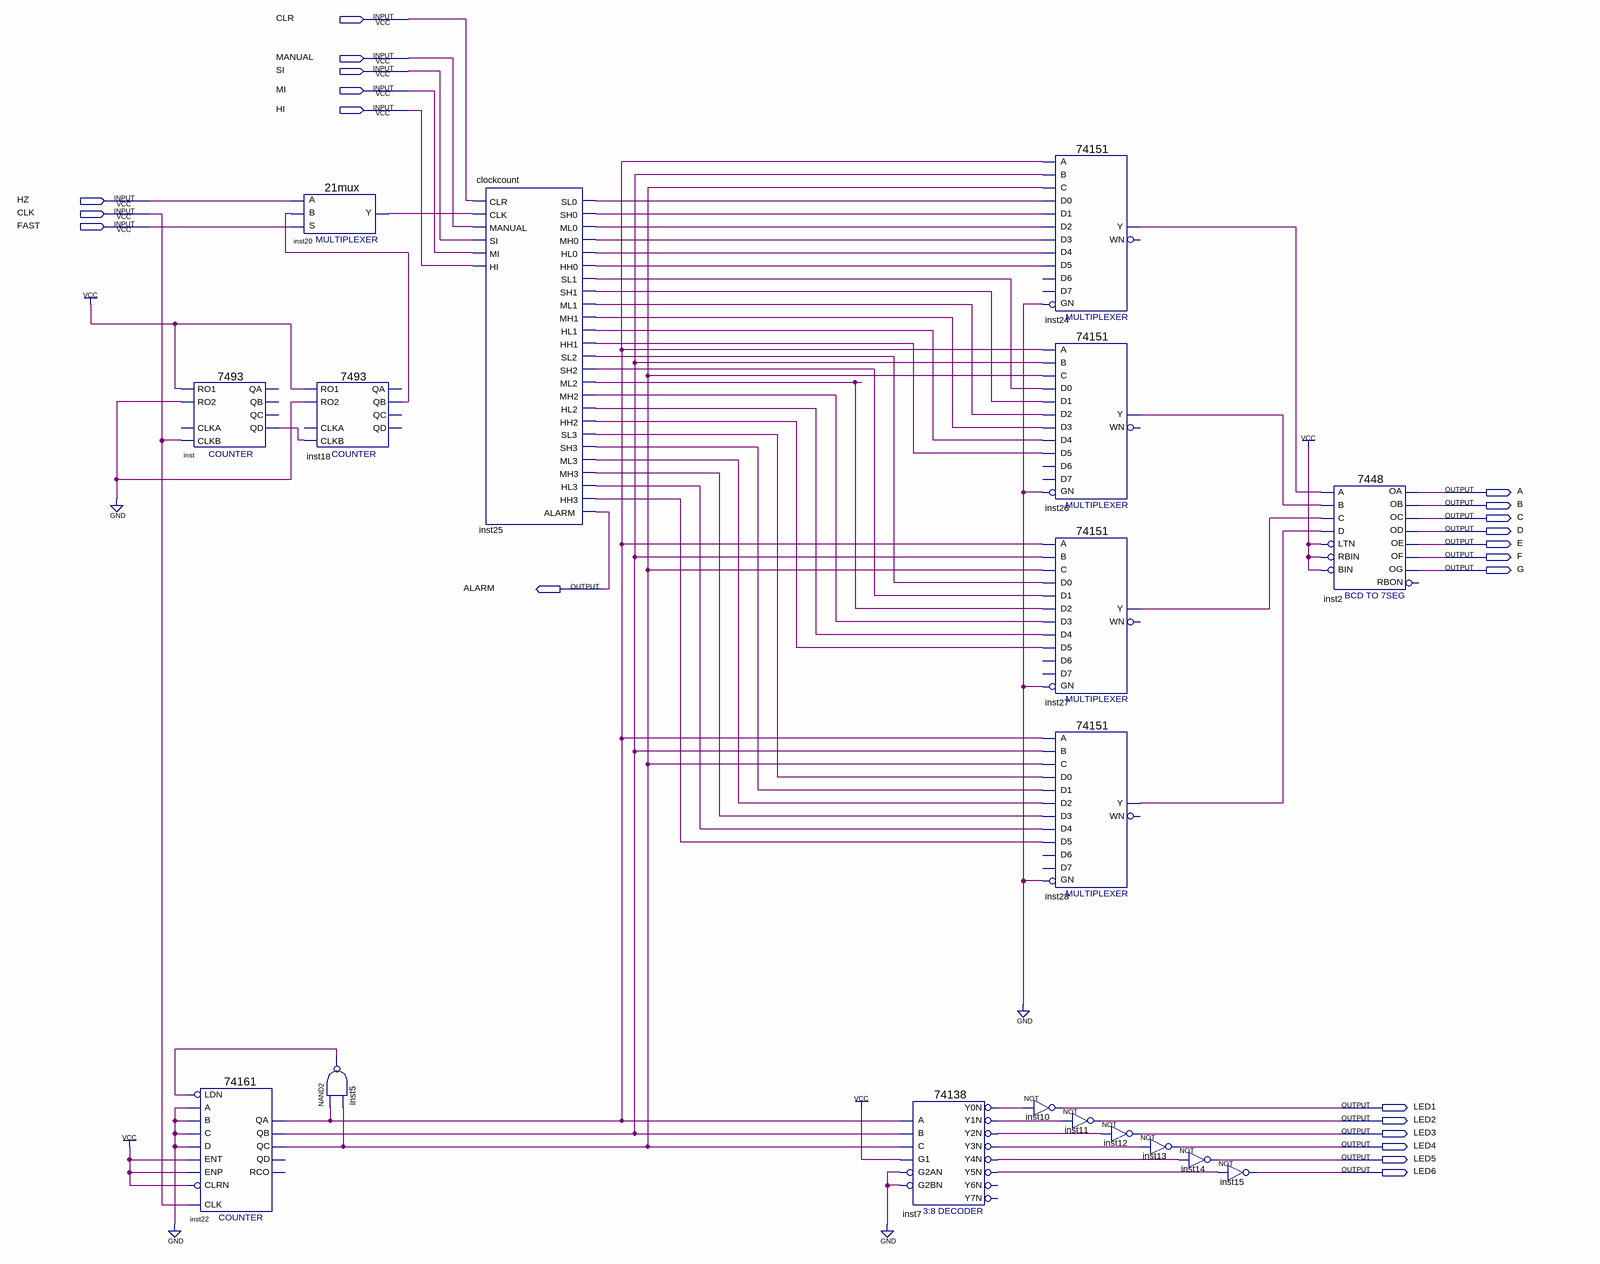
[diagram p0: schematic sheet]
// Quartus schematic clock.bdf as structural Verilog: 18 symbols, 22 pins
module clock (
  input  CLR,
  input  MANUAL,
  input  SI,
  input  MI,
  input  HI,
  input  HZ,
  input  CLK,
  input  FAST,
  output A,
  output B,
  output C,
  output D,
  output E,
  output F,
  output G,
  output ALARM,
  output LED1,
  output LED2,
  output LED3,
  output LED4,
  output LED5,
  output LED6
);

  wire inst5_out, inst7_y0n, inst7_y1n, inst7_y2n, inst7_y3n, inst7_y4n, inst7_y5n, inst18_qb, inst20_y,
       inst22_qa, inst22_qb, inst22_qc, inst24_y, inst25_hh0, inst25_hh1, inst25_hh2, inst25_hh3, inst25_hl0,
       inst25_hl1, inst25_hl2, inst25_hl3, inst25_mh0, inst25_mh1, inst25_mh2, inst25_mh3, inst25_ml0,
       inst25_ml1, inst25_ml2, inst25_ml3, inst25_sh0, inst25_sh1, inst25_sh2, inst25_sh3, inst25_sl0,
       inst25_sl1, inst25_sl2, inst25_sl3, inst26_y, inst27_y, inst28_y, inst_qd;

  \7493  inst (.RO1(1'b1), .RO2(1'b0), .CLKB(CLK), .QD(inst_qd));  // open: CLKA, QC, QB, QA
  \74161  inst22 (
    .CLRN(1'b1), .CLK(CLK), .ENP(1'b1), .LDN(inst5_out), .A(1'b0), .D(1'b0), .ENT(1'b1), .B(1'b0), .C(1'b0),
    .QC(inst22_qc), .QB(inst22_qb), .QA(inst22_qa));  // open: QD, RCO
  \21mux  inst20 (.S(FAST), .B(inst18_qb), .A(HZ), .Y(inst20_y));
  \7493  inst18 (.RO1(1'b1), .RO2(1'b0), .CLKB(inst_qd), .QB(inst18_qb));  // open: CLKA, QC, QA, QD
  nand inst5 (inst5_out, inst22_qa, inst22_qc);
  clockcount inst25 (
    .CLR(CLR), .CLK(inst20_y), .SI(SI), .MANUAL(MANUAL), .MI(MI), .HI(HI), .SL0(inst25_sl0),
    .SL1(inst25_sl1), .SL2(inst25_sl2), .SL3(inst25_sl3), .SH0(inst25_sh0), .SH1(inst25_sh1),
    .SH2(inst25_sh2), .SH3(inst25_sh3), .ML0(inst25_ml0), .ML1(inst25_ml1), .ML2(inst25_ml2),
    .ML3(inst25_ml3), .MH0(inst25_mh0), .MH1(inst25_mh1), .MH2(inst25_mh2), .MH3(inst25_mh3),
    .HL0(inst25_hl0), .HL1(inst25_hl1), .HL2(inst25_hl2), .HL3(inst25_hl3), .HH0(inst25_hh0),
    .HH1(inst25_hh1), .HH2(inst25_hh2), .HH3(inst25_hh3), .ALARM(ALARM));
  \74138  inst7 (
    .A(inst22_qa), .B(inst22_qb), .G1(1'b1), .C(inst22_qc), .G2AN(1'b0), .G2BN(1'b0), .Y0N(inst7_y0n),
    .Y1N(inst7_y1n), .Y2N(inst7_y2n), .Y3N(inst7_y3n), .Y4N(inst7_y4n), .Y5N(inst7_y5n));  // open: Y6N, Y7N
  \74151  inst24 (
    .GN(1'b0), .C(inst22_qc), .B(inst22_qb), .A(inst22_qa), .D5(inst25_hh0), .D0(inst25_sl0),
    .D1(inst25_sh0), .D4(inst25_hl0), .D3(inst25_mh0), .D2(inst25_ml0), .Y(inst24_y));  // open: D6, D7, WN
  \74151  inst26 (
    .GN(1'b0), .C(inst22_qc), .B(inst22_qb), .A(inst22_qa), .D5(inst25_hh1), .D0(inst25_sl1),
    .D1(inst25_sh1), .D4(inst25_hl1), .D3(inst25_mh1), .D2(inst25_ml1), .Y(inst26_y));  // open: D6, D7, WN
  \74151  inst27 (
    .GN(1'b0), .C(inst22_qc), .B(inst22_qb), .A(inst22_qa), .D5(inst25_hh2), .D0(inst25_sl2),
    .D1(inst25_sh2), .D4(inst25_hl2), .D3(inst25_mh2), .D2(inst25_ml2), .Y(inst27_y));  // open: D6, D7, WN
  \74151  inst28 (
    .GN(1'b0), .C(inst22_qc), .B(inst22_qb), .A(inst22_qa), .D5(inst25_hh3), .D0(inst25_sl3),
    .D1(inst25_sh3), .D4(inst25_hl3), .D3(inst25_mh3), .D2(inst25_ml3), .Y(inst28_y));  // open: D6, D7, WN
  not inst10 (LED1, inst7_y0n);
  not inst11 (LED2, inst7_y1n);
  not inst12 (LED3, inst7_y2n);
  not inst13 (LED4, inst7_y3n);
  not inst14 (LED5, inst7_y4n);
  not inst15 (LED6, inst7_y5n);
  \7448  inst2 (
    .A(inst24_y), .C(inst27_y), .D(inst28_y), .B(inst26_y), .RBIN(1'b1), .BIN(1'b1), .LTN(1'b1), .OC(C),
    .OE(E), .OD(D), .OF(F), .OG(G), .OB(B), .OA(A));  // open: RBON
endmodule
